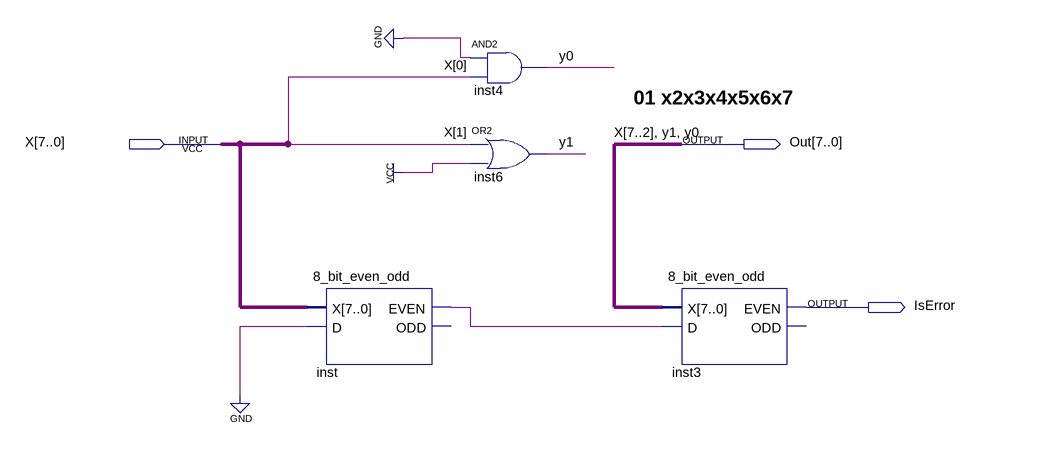
[diagram p0: schematic sheet]
// Quartus schematic error_checking.bdf as structural Verilog: 4 symbols, 3 pins
module error_checking (
  input  [7:0] X,
  output [7:0] Out,
  output IsError
);

  wire inst_even;

  \8_bit_even_odd  inst (.X(X), .D(1'b0), .EVEN(inst_even));  // open: ODD
  and inst4 (Out[0], 1'b0, X[0]);
  or inst6 (Out[1], X[1], 1'b1);
  \8_bit_even_odd  inst3 (.X({X[7:2], Out[1:0]}), .D(inst_even), .EVEN(IsError));  // open: ODD

  assign Out[7:2] = X[7:2];

  // Other names for the same wires on the sheet: y0 = Out[0]; y1 = Out[1]

  // Notes on the sheet:
  //   01 x2x3x4x5x6x7
endmodule
